# EAGLE schematic 6502-thing (EAGLE 9.6.0)
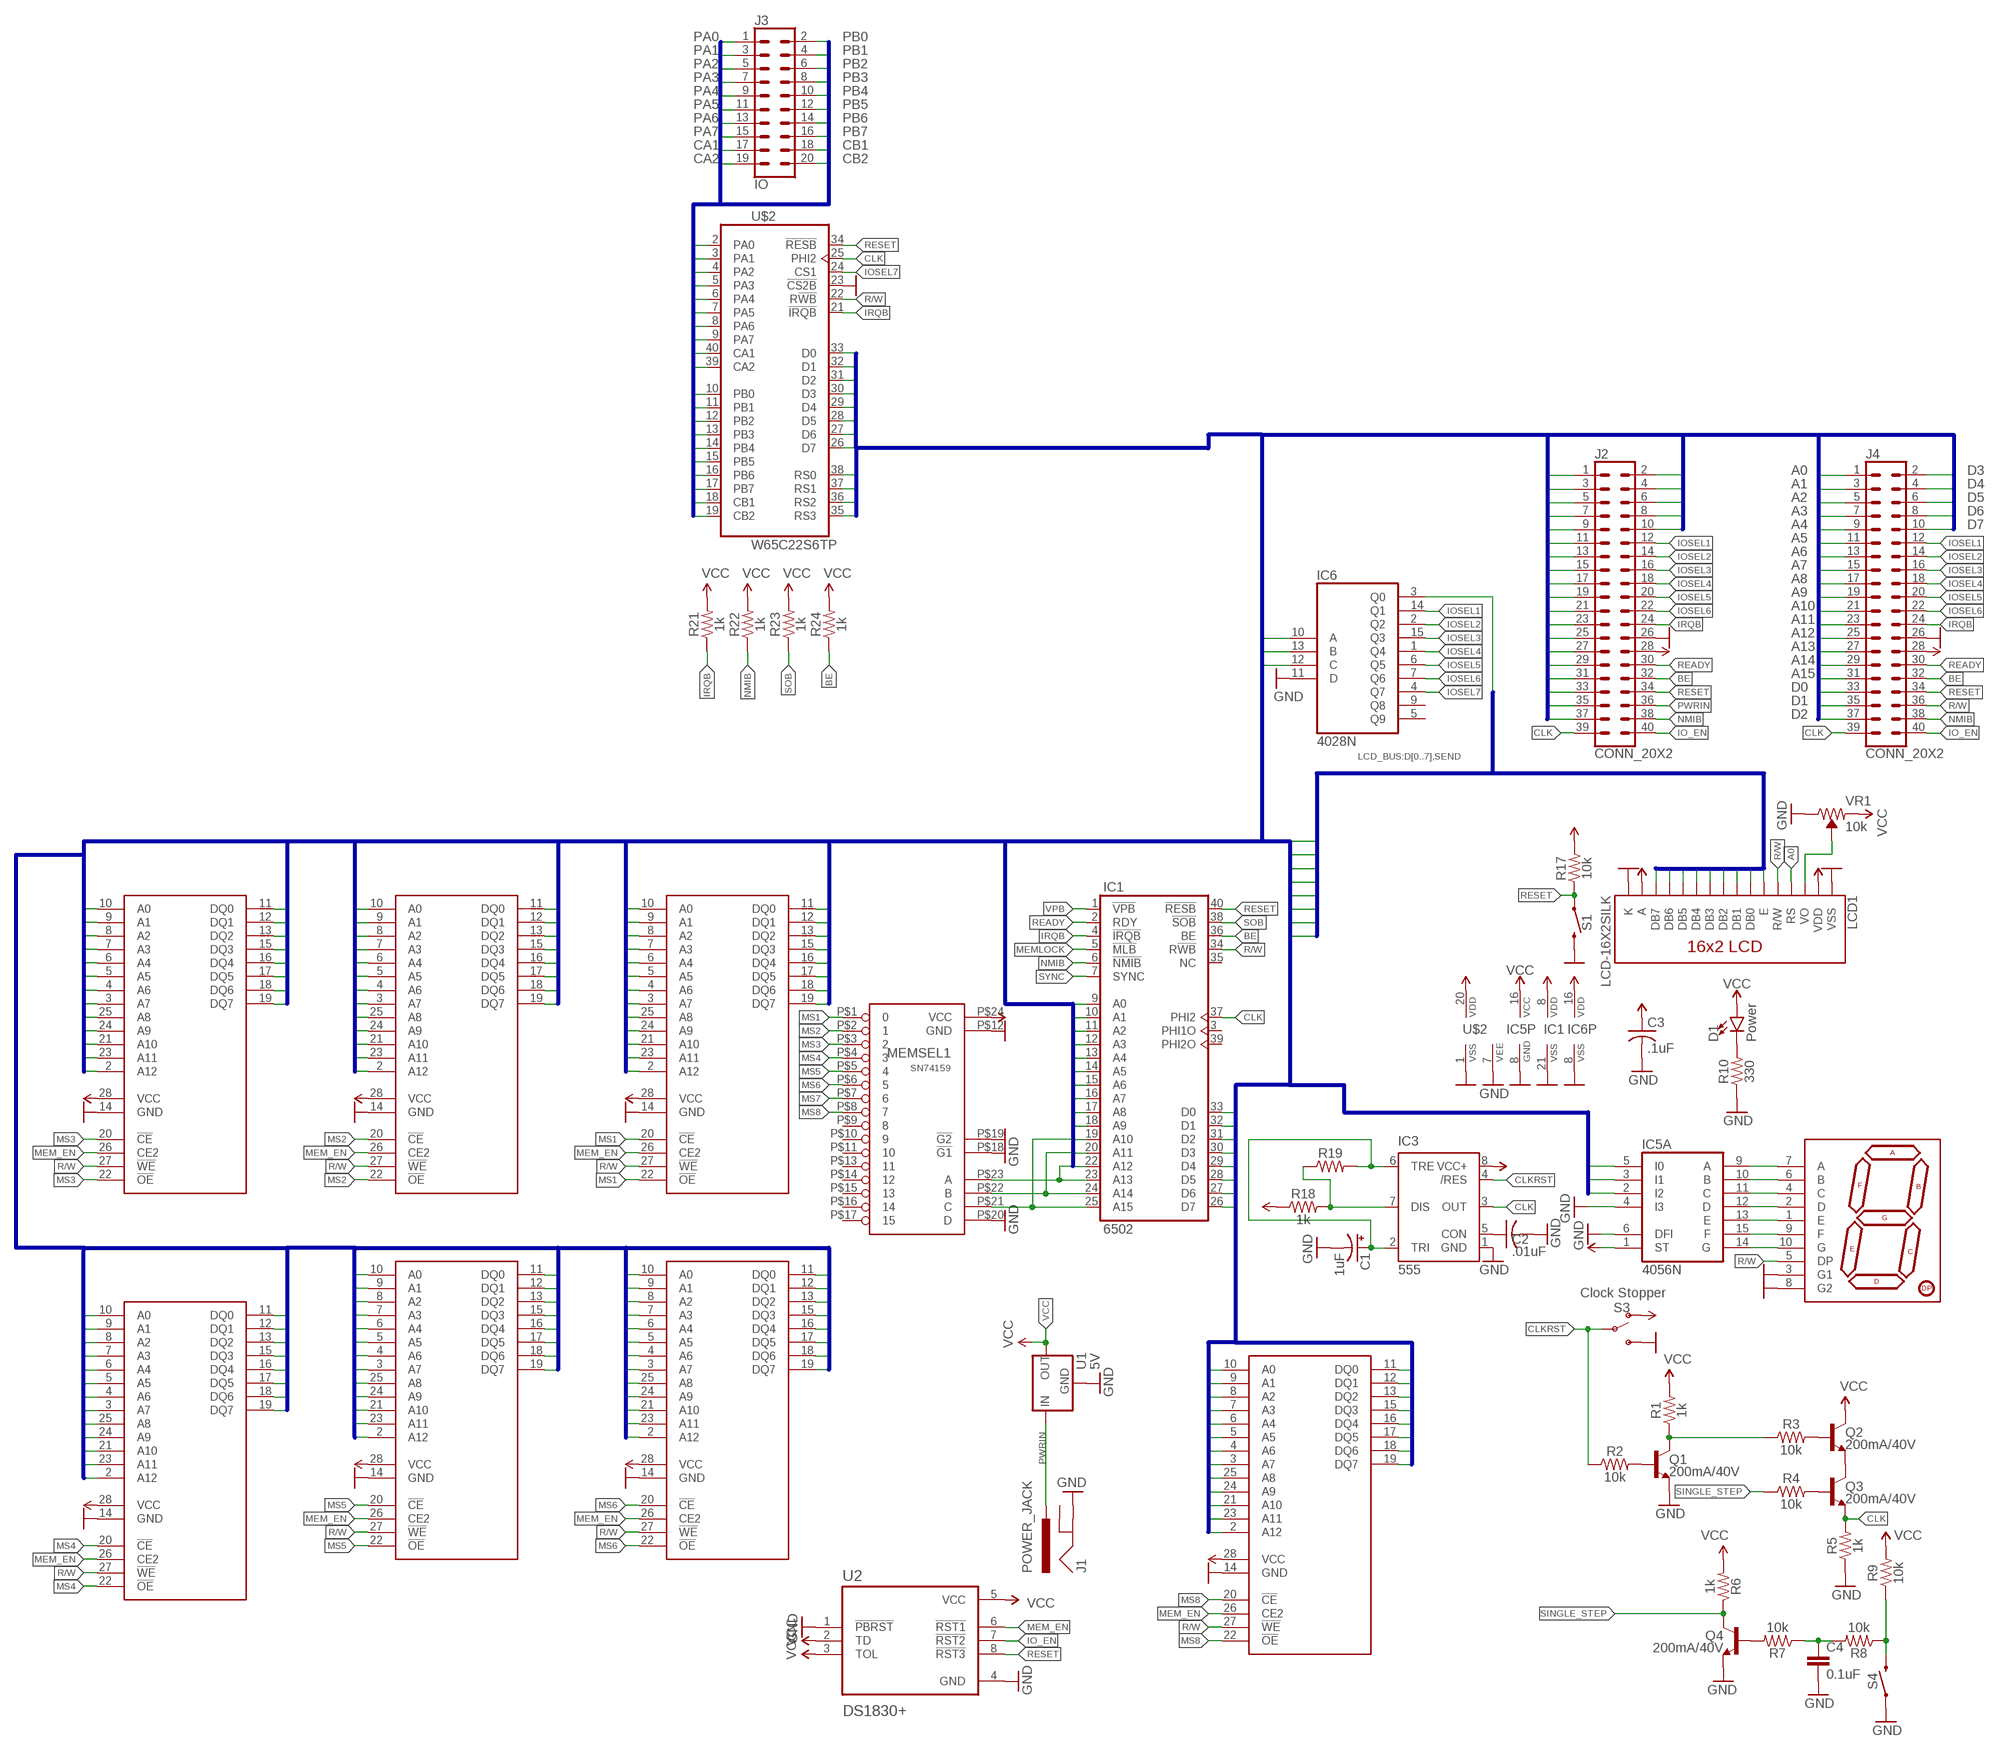
[diagram p0: schematic, sheet 1]

## Parts
C1  1uF  CPOL-USE3.5-8  [E3,5-8]
C2  .01uF  C-US025-024X044  [C025-024X044]
C3  .1uF  C-US025-024X044  [C025-024X044]
C4  0.1uF  0.1UF-KIT-EZ-50V-20%  [CAP-PTH-SMALL-KIT]
D1  Power  LED5MM  [LED_5MM]
EEPROM1  AS6C6264DIP28  [0.6"_DIP28]
IC1  6502  W65C02S6TP  [DIL40]
IC3  555  555P  [DIP08]
IC5  4056N  [DIL16]
IC6  4028N  [DIL16]
J1  POWER_JACK  [POWER_JACK_PTH]
J2  CONN_20X2  [2X20]
J3  IO  CONN_10X2  [2X10]
J4  CONN_20X2  [2X20]
LCD1  LCD-16X2SILK  [LCD-16X2]
MEMORY1  AS6C6264DIP28  [0.6"_DIP28]
MEMORY2  AS6C6264DIP28  [0.6"_DIP28]
MEMORY3  AS6C6264DIP28  [0.6"_DIP28]
MEMORY4  AS6C6264DIP28  [0.6"_DIP28]
MEMORY5  AS6C6264DIP28  [0.6"_DIP28]
MEMORY6  AS6C6264DIP28  [0.6"_DIP28]
MEMSEL1  SN74159  [0.6"_DIP24]
Q1  200mA/40V  TRANS_NPN-2N3904  [TO-92]
Q2  200mA/40V  TRANS_NPN-2N3904  [TO-92]
Q3  200mA/40V  TRANS_NPN-2N3904  [TO-92]
Q4  200mA/40V  TRANS_NPN-2N3904  [TO-92]
R1  1k  1KOHM-HORIZ-1/4W-1%  [AXIAL-0.3]
R2  10k  10KOHM-HORIZ-1/4W-1%  [AXIAL-0.3]
R3  10k  10KOHM-HORIZ-1/4W-1%  [AXIAL-0.3]
R4  10k  10KOHM-HORIZ-1/4W-1%  [AXIAL-0.3]
R5  1k  1KOHM-HORIZ-1/4W-1%  [AXIAL-0.3]
R6  1k  1KOHM-HORIZ-1/4W-1%  [AXIAL-0.3]
R7  10k  10KOHM-HORIZ-1/4W-1%  [AXIAL-0.3]
R8  10k  10KOHM-HORIZ-1/4W-1%  [AXIAL-0.3]
R9  10k  10KOHM-HORIZ-1/4W-1%  [AXIAL-0.3]
R10  330  330OHM-HORIZ-1/10W-5%  [AXIAL-0.3]
R17  10k  10KOHM-HORIZ-1/4W-1%  [AXIAL-0.3]
R18  1k  1KOHM-HORIZ-1/4W-1%  [AXIAL-0.3]
R19  1k  1KOHM-HORIZ-1/4W-1%  [AXIAL-0.3]
R21  1k  1KOHM-HORIZ-1/4W-1%  [AXIAL-0.3]
R22  1k  1KOHM-HORIZ-1/4W-1%  [AXIAL-0.3]
R23  1k  1KOHM-HORIZ-1/4W-1%  [AXIAL-0.3]
R24  1k  1KOHM-HORIZ-1/4W-1%  [AXIAL-0.3]
S1  MOMENTARY-SWITCH-SPST-PTH-6.0MM  [TACTILE_SWITCH_PTH_6.0MM]
S3  Clock Stopper  SWITCH-SPDT-PTH-11.6X4.0MM  [SWITCH_SPDT_PTH_11.6X4.0MM]
S4  MOMENTARY-SWITCH-SPST-PTH-6.0MM  [TACTILE_SWITCH_PTH_6.0MM]
U1  5V  V_REG_78XX-TO-220  [TO-220-ALT]
U2  DS1830+  [DIP794W47P254L991H457Q8]
U$1  YSD-160AB3C-8  7-SEGMENT-1DIGIT-1INCH-BLUE  [7-SEGMENT-1"PTH]
U$2  W65C22S6TP  [DIL40]
VR1  10k  TRIMPOT-PTH-10MM-KNOB-1/2W-10%  [TRIMPOT-PTH-3386U]

## Nets
A0: EEPROM1.10(A0) IC1.9(1:A0) J2.1 J4.1 LCD1.4(RS) MEMORY1.10(A0) MEMORY2.10(A0) MEMORY3.10(A0) MEMORY4.10(A0) MEMORY5.10(A0) MEMORY6.10(A0) U$2.38(VIA:RS0)
A1: EEPROM1.9(A1) IC1.10(1:A1) J2.3 J4.3 MEMORY1.9(A1) MEMORY2.9(A1) MEMORY3.9(A1) MEMORY4.9(A1) MEMORY5.9(A1) MEMORY6.9(A1) U$2.37(VIA:RS1)
A2: EEPROM1.8(A2) IC1.11(1:A2) J2.5 J4.5 MEMORY1.8(A2) MEMORY2.8(A2) MEMORY3.8(A2) MEMORY4.8(A2) MEMORY5.8(A2) MEMORY6.8(A2) U$2.36(VIA:RS2)
A3: EEPROM1.7(A3) IC1.12(1:A3) J2.7 J4.7 MEMORY1.7(A3) MEMORY2.7(A3) MEMORY3.7(A3) MEMORY4.7(A3) MEMORY5.7(A3) MEMORY6.7(A3) U$2.35(VIA:RS3)
A4: EEPROM1.6(A4) IC1.13(1:A4) J2.9 J4.9 MEMORY1.6(A4) MEMORY2.6(A4) MEMORY3.6(A4) MEMORY4.6(A4) MEMORY5.6(A4) MEMORY6.6(A4)
A5: EEPROM1.5(A5) IC1.14(1:A5) J2.11 J4.11 MEMORY1.5(A5) MEMORY2.5(A5) MEMORY3.5(A5) MEMORY4.5(A5) MEMORY5.5(A5) MEMORY6.5(A5)
A6: EEPROM1.4(A6) IC1.15(1:A6) J2.13 J4.13 MEMORY1.4(A6) MEMORY2.4(A6) MEMORY3.4(A6) MEMORY4.4(A6) MEMORY5.4(A6) MEMORY6.4(A6)
A7: EEPROM1.3(A7) IC1.16(1:A7) J2.15 J4.15 MEMORY1.3(A7) MEMORY2.3(A7) MEMORY3.3(A7) MEMORY4.3(A7) MEMORY5.3(A7) MEMORY6.3(A7)
A8: EEPROM1.25(A8) IC1.17(1:A8) J2.17 J4.17 MEMORY1.25(A8) MEMORY2.25(A8) MEMORY3.25(A8) MEMORY4.25(A8) MEMORY5.25(A8) MEMORY6.25(A8)
A9: EEPROM1.24(A9) IC1.18(1:A9) J2.19 J4.19 MEMORY1.24(A9) MEMORY2.24(A9) MEMORY3.24(A9) MEMORY4.24(A9) MEMORY5.24(A9) MEMORY6.24(A9)
A10: EEPROM1.21(A10) IC1.19(1:A10) IC6.10(A) J2.21 J4.21 MEMORY1.21(A10) MEMORY2.21(A10) MEMORY3.21(A10) MEMORY4.21(A10) MEMORY5.21(A10) MEMORY6.21(A10)
A11: EEPROM1.23(A11) IC1.20(1:A11) IC6.13(B) J2.23 J4.23 MEMORY1.23(A11) MEMORY2.23(A11) MEMORY3.23(A11) MEMORY4.23(A11) MEMORY5.23(A11) MEMORY6.23(A11)
A12: EEPROM1.2(A12) IC1.22(1:A12) IC6.12(C) J2.25 J4.25 MEMORY1.2(A12) MEMORY2.2(A12) MEMORY3.2(A12) MEMORY4.2(A12) MEMORY5.2(A12) MEMORY6.2(A12)
A13: IC1.23(1:A13) IC5.5(A:I0) J2.27 J4.27 MEMSEL1.P$23(A)
A14: IC1.24(1:A14) IC5.3(A:I1) J2.29 J4.29 MEMSEL1.P$22(B)
A15: IC1.25(1:A15) IC5.2(A:I2) J2.31 J4.31 MEMSEL1.P$21(C)
BE: IC1.36(1:BE) J2.32 J4.32 R24.P$1
CA1: J3.17 U$2.40(VIA:CA1)
CA2: J3.19 U$2.39(VIA:CA2)
CB1: J3.18 U$2.18(VIA:CB1)
CB2: J3.20 U$2.19(VIA:CB2)
CLK: IC1.37(1:PHI2) IC3.3(OUT) J2.39 J4.39 Q3.1(E) R5.P$2 U$2.25(VIA:PHI2)
CLKRST: IC3.4(/RES) R2.P$1 S3.2(P)
D0: EEPROM1.11(DQ0) IC1.33(1:D0) J2.33 J4.33 LCD1.7(DB0) MEMORY1.11(DQ0) MEMORY2.11(DQ0) MEMORY3.11(DQ0) MEMORY4.11(DQ0) MEMORY5.11(DQ0) MEMORY6.11(DQ0) U$2.33(VIA:D0)
D1: EEPROM1.12(DQ1) IC1.32(1:D1) J2.35 J4.35 LCD1.8(DB1) MEMORY1.12(DQ1) MEMORY2.12(DQ1) MEMORY3.12(DQ1) MEMORY4.12(DQ1) MEMORY5.12(DQ1) MEMORY6.12(DQ1) U$2.32(VIA:D1)
D2: EEPROM1.13(DQ2) IC1.31(1:D2) J2.37 J4.37 LCD1.9(DB2) MEMORY1.13(DQ2) MEMORY2.13(DQ2) MEMORY3.13(DQ2) MEMORY4.13(DQ2) MEMORY5.13(DQ2) MEMORY6.13(DQ2) U$2.31(VIA:D2)
D3: EEPROM1.15(DQ3) IC1.30(1:D3) J2.2 J4.2 LCD1.10(DB3) MEMORY1.15(DQ3) MEMORY2.15(DQ3) MEMORY3.15(DQ3) MEMORY4.15(DQ3) MEMORY5.15(DQ3) MEMORY6.15(DQ3) U$2.30(VIA:D3)
D4: EEPROM1.16(DQ4) IC1.29(1:D4) J2.4 J4.4 LCD1.11(DB4) MEMORY1.16(DQ4) MEMORY2.16(DQ4) MEMORY3.16(DQ4) MEMORY4.16(DQ4) MEMORY5.16(DQ4) MEMORY6.16(DQ4) U$2.29(VIA:D4)
D5: EEPROM1.17(DQ5) IC1.28(1:D5) J2.6 J4.6 LCD1.12(DB5) MEMORY1.17(DQ5) MEMORY2.17(DQ5) MEMORY3.17(DQ5) MEMORY4.17(DQ5) MEMORY5.17(DQ5) MEMORY6.17(DQ5) U$2.28(VIA:D5)
D6: EEPROM1.18(DQ6) IC1.27(1:D6) J2.8 J4.8 LCD1.13(DB6) MEMORY1.18(DQ6) MEMORY2.18(DQ6) MEMORY3.18(DQ6) MEMORY4.18(DQ6) MEMORY5.18(DQ6) MEMORY6.18(DQ6) U$2.27(VIA:D6)
D7: EEPROM1.19(DQ7) IC1.26(1:D7) J2.10 J4.10 LCD1.14(DB7) MEMORY1.19(DQ7) MEMORY2.19(DQ7) MEMORY3.19(DQ7) MEMORY4.19(DQ7) MEMORY5.19(DQ7) MEMORY6.19(DQ7) U$2.26(VIA:D7)
GND [power]: C1.- C2.2 C3.2 C4.2 EEPROM1.14(GND) IC1.21(P:VSS) IC3.1(GND) IC5.4(A:I3) IC5.6(A:DFI) IC5.7(P:VEE) IC5.8(P:GND) IC6.8(VSS) IC6.11(D) J1.GND J2.26 J4.26 LCD1.1(VSS) LCD1.16(K) MEMORY1.14(GND) MEMORY2.14(GND) MEMORY3.14(GND) MEMORY4.14(GND) MEMORY5.14(GND) MEMORY6.14(GND) MEMSEL1.P$12(GND) MEMSEL1.P$18(!G1!) MEMSEL1.P$19(!G2!) MEMSEL1.P$20(D) Q1.1(E) Q4.1(E) R5.P$1 R10.P$1 S1.3 S3.3(S) S4.1 U1.GND U2.1(!PBRST) U2.4(GND) U$1.3(G1) U$1.8(G2) U$2.1(VIAP:VSS) U$2.23(VIA:!CS2B) VR1.3(CW)
IO_EN: J2.40 J4.40 U2.7(!RST2)
IOSEL1: IC6.14(Q1) J2.12 J4.12
IOSEL2: IC6.2(Q2) J2.14 J4.14
IOSEL3: IC6.15(Q3) J2.16 J4.16
IOSEL4: IC6.1(Q4) J2.18 J4.18
IOSEL5: IC6.6(Q5) J2.20 J4.20
IOSEL6: IC6.7(Q6) J2.22 J4.22
IOSEL7: IC6.4(Q7) U$2.24(VIA:CS1)
IRQB: IC1.4(1:!IRQB) J2.24 J4.24 R21.P$1 U$2.21(VIA:!IRQB)
MEM_EN: EEPROM1.26(CE2) MEMORY1.26(CE2) MEMORY2.26(CE2) MEMORY3.26(CE2) MEMORY4.26(CE2) MEMORY5.26(CE2) MEMORY6.26(CE2) U2.6(!RST1)
MEMLOCK: IC1.5(1:!MLB)
MS1: MEMORY1.20(!CE!) MEMORY1.22(!OE!) MEMSEL1.P$1
MS2: MEMORY2.20(!CE!) MEMORY2.22(!OE!) MEMSEL1.P$2
MS3: MEMORY3.20(!CE!) MEMORY3.22(!OE!) MEMSEL1.P$3
MS4: MEMORY4.20(!CE!) MEMORY4.22(!OE!) MEMSEL1.P$4
MS5: MEMORY5.20(!CE!) MEMORY5.22(!OE!) MEMSEL1.P$5
MS6: MEMORY6.20(!CE!) MEMORY6.22(!OE!) MEMSEL1.P$6
MS7: MEMSEL1.P$7
MS8: EEPROM1.20(!CE!) EEPROM1.22(!OE!) MEMSEL1.P$8
N$2: Q1.3(C) R1.P$1 R3.P$1
N$3: Q1.2(B) R2.P$2
N$4: Q2.2(B) R3.P$2
N$5: Q3.2(B) R4.P$2
N$6: Q2.1(E) Q3.3(C)
N$8: C1.+ IC3.2(TRI) IC3.6(TRE) R19.P$2
N$9: Q4.2(B) R7.P$2
N$10: C4.1 R7.P$1 R8.P$2
N$11: R8.P$1 R9.P$1 S4.3
N$12: D1.K(C) R10.P$2
N$15: LCD1.3(VO) VR1.2(WIPER)
N$19: IC3.7(DIS) R18.P$2 R19.P$1
N$21: C2.1 IC3.5(CON)
N$24: IC5.9(A:A) U$1.7(A)
N$25: IC5.10(A:B) U$1.6(B)
N$26: IC5.11(A:C) U$1.4(C)
N$27: IC5.12(A:D) U$1.2(D)
N$28: IC5.13(A:E) U$1.1(E)
N$29: IC5.15(A:F) U$1.9(F)
N$30: IC5.14(A:G) U$1.10(G)
NMIB: IC1.6(1:!NMIB) J2.38 J4.38 R22.P$1
PA0: J3.1 U$2.2(VIA:PA0)
PA1: J3.3 U$2.3(VIA:PA1)
PA2: J3.5 U$2.4(VIA:PA2)
PA3: J3.7 U$2.5(VIA:PA3)
PA4: J3.9 U$2.6(VIA:PA4)
PA5: J3.11 U$2.7(VIA:PA5)
PA6: J3.13 U$2.8(VIA:PA6)
PA7: J3.15 U$2.9(VIA:PA7)
PB0: J3.2 U$2.10(VIA:PB0)
PB1: J3.4 U$2.11(VIA:PB1)
PB2: J3.6 U$2.12(VIA:PB2)
PB3: J3.8 U$2.13(VIA:PB3)
PB4: J3.10 U$2.14(VIA:PB4)
PB5: J3.12 U$2.15(VIA:PB5)
PB6: J3.14 U$2.16(VIA:PB6)
PB7: J3.16 U$2.17(VIA:PB7)
PWRIN [power]: J1.PWR J2.36 U1.IN
R/W: EEPROM1.27(!WE!) IC1.34(1:R!WB) J4.36 LCD1.5(R/W) MEMORY1.27(!WE!) MEMORY2.27(!WE!) MEMORY3.27(!WE!) MEMORY4.27(!WE!) MEMORY5.27(!WE!) MEMORY6.27(!WE!) U$1.5(DP) U$2.22(VIA:R!WB)
READY: IC1.2(1:RDY) J2.30 J4.30
RESET: IC1.40(1:!RESB) J2.34 J4.34 R17.P$1 S1.1 U2.8(!RST3) U$2.34(VIA:!RESB)
SEND: IC6.3(Q0) LCD1.6(E)
SINGLE_STEP: Q4.3(C) R4.P$1 R6.P$1
SOB: IC1.38(1:!SOB) R23.P$1
SYNC: IC1.7(1:SYNC)
VCC [power]: C3.1 D1.A EEPROM1.28(VCC) IC1.8(P:VDD) IC3.8(VCC+) IC5.1(A:ST) IC5.16(P:VCC) IC6.16(VDD) J2.28 J4.28 LCD1.2(VDD) LCD1.15(A) MEMORY1.28(VCC) MEMORY2.28(VCC) MEMORY3.28(VCC) MEMORY4.28(VCC) MEMORY5.28(VCC) MEMORY6.28(VCC) MEMSEL1.P$24(VCC) Q2.3(C) R1.P$2 R6.P$2 R9.P$2 R17.P$2 R18.P$1 R21.P$2 R22.P$2 R23.P$2 R24.P$2 S3.1(O) U1.OUT U2.2(TD) U2.3(TOL) U2.5(VCC) U$2.20(VIAP:VDD) VR1.1(CCW)
VPB: IC1.1(1:!VPB)
Unconnected: IC1.3(1:PHI1O) IC1.35(1:NC) IC1.39(1:PHI2O) IC6.5(Q9) IC6.9(Q8) J1.GNDBREAK MEMSEL1.P$9 MEMSEL1.P$10 MEMSEL1.P$11 MEMSEL1.P$13 MEMSEL1.P$14 MEMSEL1.P$15 MEMSEL1.P$16 MEMSEL1.P$17

## Buses
DATABUS:A[0..15],D[0..7]
LCD_BUS:D[0..7],SEND
IOBUS:CA[1..2],CB[1..2],PA[0..7],PB[0..7]

## Library data of the parts
C1 = rcl:CPOL-US: POLARIZED CAPACITOR, American symbol; SPICEPREFIX: C
C2 C3 = rcl:C-US: CAPACITOR, American symbol; SPICEPREFIX: C
C4 = SparkFun-Capacitors:0.1UF: 0.1µF ceramic capacitors A capacitor is a passive two-terminal electrical component used to store electrical energy temporarily in an electric field.; PROD_ID: CAP-08370
D1 = SparkFun-LED:LED: LED (Generic) Standard schematic elements and footprints for 5mm, 3mm, 1206, and 0603 sized LEDs. Generic LEDs with no color specified.
EEPROM1 MEMORY1-MEMORY6 = extra-bits:AS6C6264: 64K SRAM chip Datasheet: https://www.alliancememory.com/wp-content/uploads/pdf/Alliance%20Memory_64K_AS6C6264v2.0July2017.pdf
IC1 = 6502:W65C02S: W65C02 by WDC
IC3 = SparkFun-IC-Special-Function:555: General purpose bipolar Timer Datasheet <http://www.sparkfun.com/datasheets/Components/General/ne555.pdf> SparkFun Products SparkFun SparkPunk Sequencer Kit <https://www.sparkfun.com/products/12707> (KIT-12707) Storefront Component: 555 Timer <https://www.sparkfun.com/products/9273> (COM-09273) Two parts valid for production: VFP: IC-11930 (M7555 PTH) VFP: IC-09173 (555 PTH) - Preferred; PROD_ID: IC-09173; PROD_ID_ALT: IC-09173
IC5 = 40xx-modified:4056: BCD to 7-segment LCD DECODER/DRIVER
IC6 = 40xx:4028: BCD to decimal DECODER
J1 = SparkFun-Connectors:POWER_JACK: Power Jack Connector This is the standard 5.5mm barrel jack for power. The PTH is the most common, proven, reliable, footprint. The Slot footprint only works if the mill layer is transmitted to the PCB fab house so be warned. Here are the connectors we sell at SparkFun: DC Barrel Power Jack/Connector <https://www.sparkfun.com/products/119> (PRT-00119) DC Barrel Power Jack/Connector (SMD) <https://www.sparkfun.com/products/12748> (PRT-12748) DC Barrel Jack Adapter - Breadboard Compatible <https://www.sparkfun.com/products/10811> (PRT-10811) It is used on this SparkFun product (and many, many others): SparkFun RedBoard - Programmed with Arduino <https://www.sparkfun.com/products/12757> (DEV-12757) Also, if you need a mating power supply or connector, please check these out: Wall Adapter Power Supply - 9VDC 650mA <https://www.sparkfun.com/products/298> (TOL-00298) DC Barrel Jack Adapter - Male <https://www.sparkfun.com/products/10287> (PRT-10287); PROD_ID: CONN-08197
J2 J4 = SparkFun-Connectors:CONN_20X2: Multi connection point. Often used as Generic Header-pin footprint for 0.1 inch spaced/style header connections On any of the 0.1 inch spaced packages, you can populate with these: Break Away Headers - Straight <https://www.sparkfun.com/products/116> (PRT-00116) Break Away Male Headers - Right Angle <https://www.sparkfun.com/products/553> (PRT-00553) Female Headers <https://www.sparkfun.com/products/115> (PRT-00115) Break Away Headers - Machine Pin <https://www.sparkfun.com/products/117> (PRT-00117) Break Away Female Headers - Swiss Machine Pin <https://www.sparkfun.com/products/743> (PRT-00743)
J3 = SparkFun-Connectors:CONN_10X2: Multi connection point. Often used as Generic Header-pin footprint for 0.1 inch spaced/style header connections On any of the 0.1 inch spaced packages, you can populate with these: Break Away Headers - Straight <https://www.sparkfun.com/products/116> (PRT-00116) Break Away Male Headers - Right Angle <https://www.sparkfun.com/products/553> (PRT-00553) Female Headers <https://www.sparkfun.com/products/115> (PRT-00115) Break Away Headers - Machine Pin <https://www.sparkfun.com/products/117> (PRT-00117) Break Away Female Headers - Swiss Machine Pin <https://www.sparkfun.com/products/743> (PRT-00743) Special note about the "SPECIAL" package: This was SPECIALLY designed to be used with our Graphic LCD Backpack. Be sure you want to use this! It is not only staggered on each line of header holes, but IT IS ALSO offset of the center point of the top and bottom lines by 5 mil. This causes the headers to lock into place on the "standard" footprint on the LCD screen. The extra squares on the tdocu layer are there simply to reference other pins (if you were to actually populate a longer header than ten long - this is what we do with the backpacks).
LCD1 = SparkFun-Displays:LCD-16X2: Standard text-only 16x2 parallel input LCD Basic 16 character by 2 line display. Typically utilizes the extremely common HD44780 parallel interface chipset SparkFun Products: Basic 16x2 Green <https://www.sparkfun.com/products/255> Basic 8x2 Green <https://www.sparkfun.com/products/11122>; PROD_ID: LCD-12633; SF_ID: LCD-00255
MEMSEL1 = extra-bits:SN74159
Q1-Q4 = SparkFun-DiscreteSemi:TRANS_NPN: NPN transistor Current controlled devices typically used to amplify current or used as a switch. BC547 - COM-08928 <http://www.sparkfun.com/products/8928> (TO-92 45V 100mA) (1.Collector 2.Base 3.Emitter) 2N3904 - COM-00521 <http://www.sparkfun.com/products/521> (TO-92 40V 200mA) (1.Emitter 2.Base 3.Collector) P2N2222A - COM-12852 <http://www.sparkfun.com/products/12852> (TO-92 40V 600mA) (1.Collector 2.Base 3.Emitter); PROD_ID: TRANS-08447
R1 R5 R6 R18 R19 R21-R24 = SparkFun-Resistors:1KOHM: 1kΩ resistor A resistor is a passive two-terminal electrical component that implements electrical resistance as a circuit element. Resistors act to reduce current flow, and, at the same time, act to lower voltage levels within circuits. - Wikipedia; PROD_ID: RES-12182
R2-R4 R7-R9 R17 = SparkFun-Resistors:10KOHM: 10kΩ resistor A resistor is a passive two-terminal electrical component that implements electrical resistance as a circuit element. Resistors act to reduce current flow, and, at the same time, act to lower voltage levels within circuits. - Wikipedia; PROD_ID: RES-12183
R10 = SparkFun-Resistors:330OHM: 330Ω resistor A resistor is a passive two-terminal electrical component that implements electrical resistance as a circuit element. Resistors act to reduce current flow, and, at the same time, act to lower voltage levels within circuits. - Wikipedia; PROD_ID: RES-8371
S1 S4 = SparkFun-Switches:MOMENTARY-SWITCH-SPST: Momentary Switch (Pushbutton) - SPST Normally-open (NO) SPST momentary switches (buttons, pushbuttons). Variants PTH-12MM - 12mm square, through-hole Momentary Pushbutton Switch - 12mm Square <https://www.sparkfun.com/products/9190> (COM-09190) PTH-6.0MM, PTH-6.0MM-KIT - 6.0mm square, through-hole Mini Pushbutton Switch <https://www.sparkfun.com/products/97> (COM-00097) KIT package intended for soldering kit's - only one side of pads' copper is exposed. PTH-RIGHT-ANGLE-KIT - Right-angle, through-hole Right Angle Tactile Button <https://www.sparkfun.com/products/10791> - Used on SparkFun BigTime Watch Kit <https://www.sparkfun.com/products/11734> SMD-12MM - 12mm square, surface-mount Tactile Button - SMD (12mm) <https://www.sparkfun.com/products/12993> (COM-12993) Used on SparkFun PicoBoard <https://www.sparkfun.com/products/11888> SMD-4.5MM - 4.5mm Square Trackball Switch Used on SparkFun Blackberry Trackballer Breakout <https://www.sparkfun.com/products/13169> SMD-4.6MMX2.8MM - 4.60mm x 2.80mm, surface mount Used on SparkFun SAMD21 Mini Breakout <https://www.sparkfun.com/products/13664> SMD-5.2MM, SMD-5.2-REDUNDANT - 5.2mm square, surface-mount Mini Pushbutton Switch - SMD <https://www.sparkfun.com/products/8720> (COM-08720) Used on Arduino Pro Mini <https://www.sparkfun.com/products/11114> REDUNDANT package connects both switch circuits together SMD-6.0X3.5MM - 6.0 x 3.5mm, surface mount Momentary Reset Switch SMD <https://www.sparkfun.com/products/8229> (COM-08229) SMD-6.2MM-TALL - 6.2mm square, surface mount Tactile Button - SMD (6mm) <https://www.sparkfun.com/products/12992> Used on SparkFun Digital Sandbox <https://www.sparkfun.com/products/12651> SMD-RIGHT-ANGLE - Right-angle, surface mount Used on SparkFun Block for Intel® Edison - Arduino <https://www.sparkfun.com/products/13036>; PROD_ID: SWCH-08441; SF_SKU: COM-00097
S3 = SparkFun-Switches:SWITCH-SPDT: Single Pole, Double Throw (SPDT) Switch Single-pole, double-throw (SPDT) switch. Variant Overview SMD-AYZ0202 Surface Mount DPDT Switch <https://www.sparkfun.com/products/597> (COM-00597) Used on e.g. LilyPad Arduino USB - ATmega32U4 Board <https://www.sparkfun.com/products/12049> PTH-11.6X4.0MM SPDT Mini Power Switch <https://www.sparkfun.com/products/102> (COM-00102) Used on e.g. SparkFun Simon Says - Through-Hole Soldering Kit <https://www.sparkfun.com/products/10547> (KIT-10547) PTH-11.6X4.0MM-KIT KIT version of SPDT Mini Power Switch - Simplifies soldering by removing tStop of switch pins - only one side can be soldered. PTH-11.6X4.0MM-LOCK LOCK version of SPDT Mini Power Switch - Offset pins hold switch in place for easier soldering. SMD-RIGHT-ANGLE Surface Mount Right Angle Switch <https://www.sparkfun.com/products/10860> (COM-10860) Used on e.g. SparkFun ESP8266 Thing <https://www.sparkfun.com/products/13231>; PROD_ID: SWCH-08261; SF_SKU: COM-00102
U1 = SparkFun-IC-Power:V_REG_78XX: Voltage Regulator Standard 78xx regulator. IGO (Input Ground Output). Spark Fun Electronics SKU : COM-00107; PROD_ID: VREG-08450; SF_ID: COM-00107
U2 = DS1830_:DS1830+: None; AVAILABILITY: Unavailable; DESCRIPTION: Processor Supervisor 4.62V 1V to 5.5V 8-Pin PDIP N; MF: Maxim Integrated; MP: DS1830+; PACKAGE: PDIP-8 Maxim; PRICE: None
U$1 = SparkFun-LED:7-SEGMENT-1DIGIT-1INCH: 7-Segment Display, single digit, 1" EZ is for kits. Pads are only exposed on the bottom side to help prevent soldering in upside down. Datasheet (Red) <https://cdn.sparkfun.com/datasheets/Components/LED/YSD-160AR4B-8.pdf> Datasheet (Blue) <https://cdn.sparkfun.com/datasheets/Components/LED/YSD-160AB3C-8.pdf> SparkFun Products 7-Segment Display - LED (Red) <https://www.sparkfun.com/products/8546> (COM-08546) 7-Segment Display - LED (Blue) <https://www.sparkfun.com/products/9191> (COM-09191); PROD_ID: COMP-09495
U$2 = 6502:W65C22S: W65C22 by WDC
VR1 = SparkFun-Resistors:TRIMPOT: Trimming Potentiometer (Trimpot) Three-terminal potentiometers, with an adjustable wiper and two adjustable resistors. A pot can be used to create a configurable voltage divider, or as a variable resistor. "Trimpots" are a subset of potentiometers, usually intended for "set-and-forget" applications. They're often more delicate than standard potentiometers - rated for fewer turns. Variants PTH-KNOB - PTH Trimpot w/ finger-adjustable knob Trimpot 10K with Knob <https://www.sparkfun.com/products/9806> (COM-09806) Datasheet <http://www.sparkfun.com/datasheets/Components/General/TSR-3386.pdf> SMD-3MM-CLOSED-FRAME - SMD 3mm Square Closed-Frame Trimpot Used on e.g. EasyDriver - Stepper Motor Driver <https://www.sparkfun.com/products/12779> Datasheet <http://www.bitechnologies.com/pdfs/22.pdf> (22AR10KTR) SMD-5MM - SMD 5mm Square Closed-Frame Trimpot Used on e.g. IOIO-OTG - V2.2 <https://www.sparkfun.com/products/13613> Datasheet <http://www.vishay.com/docs/51008/ts53.pdf> (TS53YL502MR10) SMD-3MM-1/10W-25% - 3mm Square Open-Frame Trimpot Used on e.g. SparkFun Shapeoko <https://www.sparkfun.com/products/13899> Datasheet <http://www.bourns.com/docs/Product-Datasheets/TC33.pdf> (TC33X-2-103E); PROD_ID: RES-09730; SF_SKU: COM-09806

## Net classes
0 default: width 0.254 mm, clearance 0.127 mm
1 power: width 0.508 mm, clearance 0.254 mm to class 0, clearance 0.127 mm